# EAGLE design tricorder-sensor-veml6075-mk-1.0 (EAGLE 7.5.0)
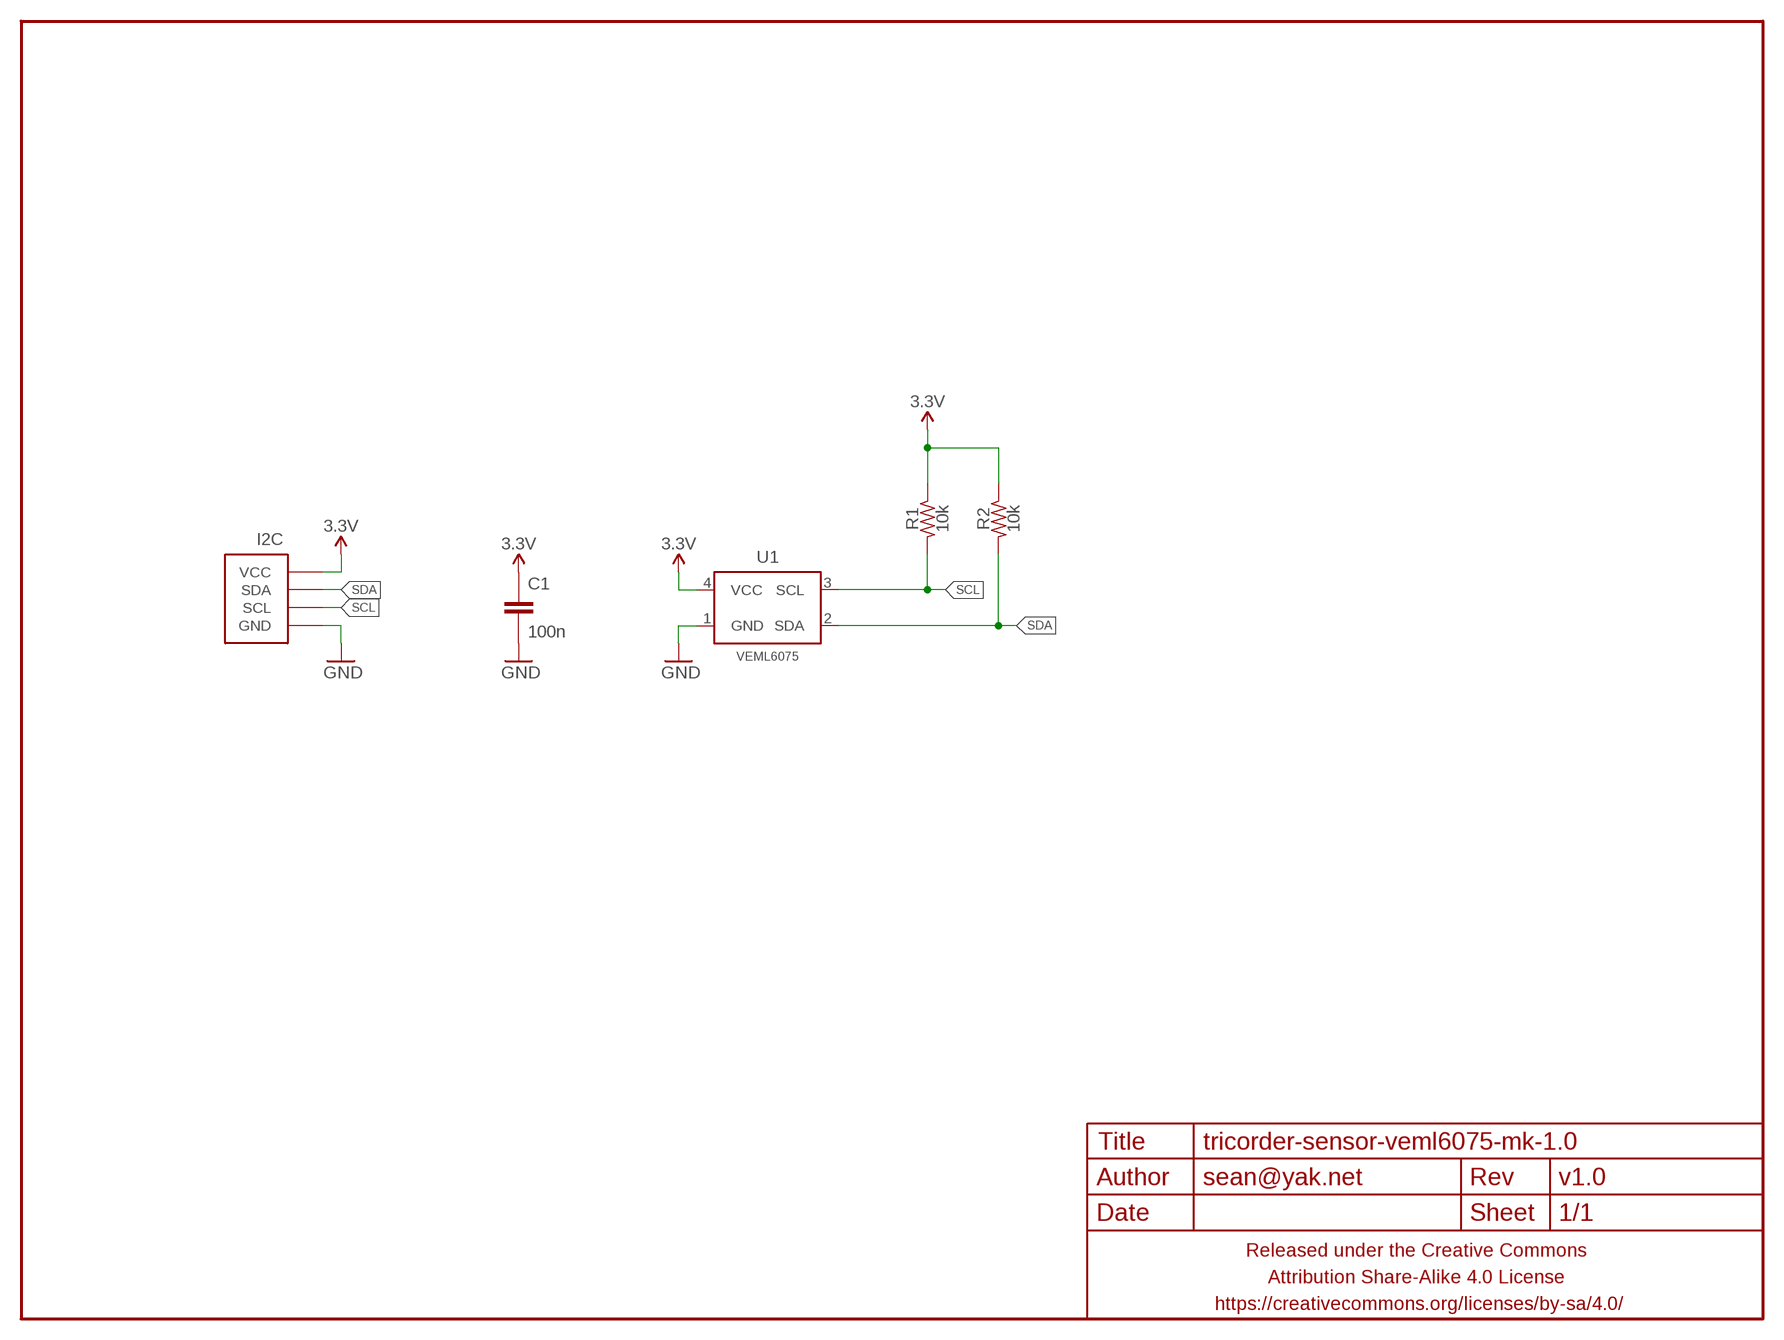
[diagram p0: schematic, sheet 1]

## Parts
C1  100n  CAPACITOR-CERAMICC0603  [C0603]
FRAME1  FRAME-LETTERNO_PACKAGE  [DUMMY]
I2C  M04-I2CPTH-0.1IN-CENTERED  [1X04-PTH-VERT-I2C-CENTERED]
R1  10k  RESISTORR0603  [R0603]
R2  10k  RESISTORR0603  [R0603]
U1  VEML6075  [OPLGA4]

## Nets
3.3V: C1.1 I2C.VCC R1.1 R2.1 U1.4(VCC)
GND: C1.2 I2C.GND U1.1(GND)
SCL: I2C.SCL R1.2 U1.3(SCL)
SDA: I2C.SDA R2.2 U1.2(SDA)

## Library data of the parts
C1 = a_parts:CAPACITOR-CERAMIC: CAPACITOR, European symbol
FRAME1 = a_parts:FRAME-LETTER: Schematic Frame Standard 8.5x11 US Letter frame; DESIGNER: sean@yak.net; VERSION: v1.0
I2C = a_parts:M04-I2C
R1 R2 = a_parts:RESISTOR: RESISTOR, American symbol
U1 = a_parts:VEML6075

## Board
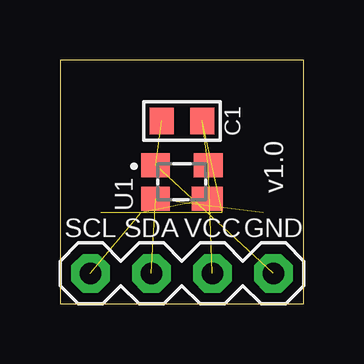
[diagram p1: board, top side]
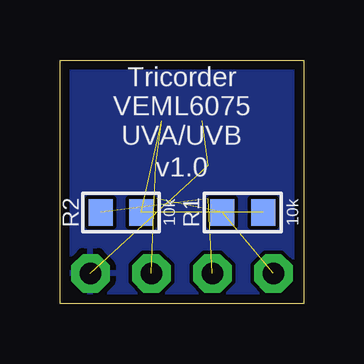
[diagram p2: board, bottom side, seen from below]

Size 10.16 x 10.16 mm. Coordinates in mm from the lower left corner, seen from the top.
Outline: 0,10.16 0,0 10.16,0 10.16,10.16 0,10.16
Copper layers (1*16): Top 0.0356mm / dielectric 1.5011mm / Bottom 0.0356mm
Design rules "LaenPCBOrder2": minimum track width 6mil, minimum drill 13mil, track to track 6mil, track to pad 6mil, pad to pad 6mil, via to via 6mil, smd to smd 6mil, copper to edge 15mil, drill to drill 6mil, minimum pad ring 7mil, minimum via ring 7mil, stop-mask expansion 3mil, vias tented up to drill 20mil, thermal gap 10mil

### Footprints (pad centres in the part's own frame; a part is rotated, then mirrored left to right if it is on the bottom)
C0603 = smd 1 x 1.1: 1 -0.85,0; 2 0.85,0
1X04-PTH-VERT-I2C-CENTERED = drill 0.9 pad 1.6 octagon: GND -3.81,0; SCL 3.81,0; SDA 1.27,0; VCC -1.27,0
R0603 = smd 1 x 1.1: 1 -0.85,0; 2 0.85,0
OPLGA4 = smd 1.2 x 1: 1 -1.1,0.7; 2 -1.1,-0.7; 4 1.1,0.7 | smd 1.3 x 1: 3 1.05,-0.7

### Placement (x,y rotation side)
C1  5.08,7.62 180 top
FRAME1  0,0 0 top
I2C  5.08,1.27 180 top
R1  2.54,3.81 180 bottom
R2  7.62,3.81 180 bottom
U1  5.08,5.08 0 top

### Tracks (layer width: path | path; a pad name or v marks a point on that pad's centre or on a via)
3.3V  (4 unrouted)
GND  (2 unrouted)
  pour Bottom: 0,10.16 0,0 10.16,0 10.16,10.16
SCL  (2 unrouted)
SDA  (2 unrouted)

### Text on the board
bPlace: Tricorder / VEML6075 / UVA/UVB